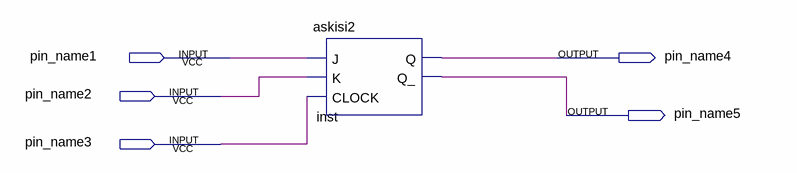
[diagram p0: schematic sheet]
// Quartus schematic Block1.bdf as structural Verilog: 1 symbols, 5 pins
module Block1 (
  input  pin_name1,
  input  pin_name2,
  input  pin_name3,
  output pin_name4,
  output pin_name5
);

  askisi2 inst (.J(pin_name1), .K(pin_name2), .CLOCK(pin_name3), .Q(pin_name4), .Q_(pin_name5));
endmodule
